# Altium schematic sheet Elevate_sch.SchDoc: CopterControl 3D
size A3; Author: David Ankers; DrawnBy: David Ankers; Engineer: David Ankers; Organization: The OpenPilot Project; DocumentNumber: 1; Revision: A; SheetNumber: 1; SheetTotal: 1; License: Creative Commons BY-SA; ProjectName: OpenPilot
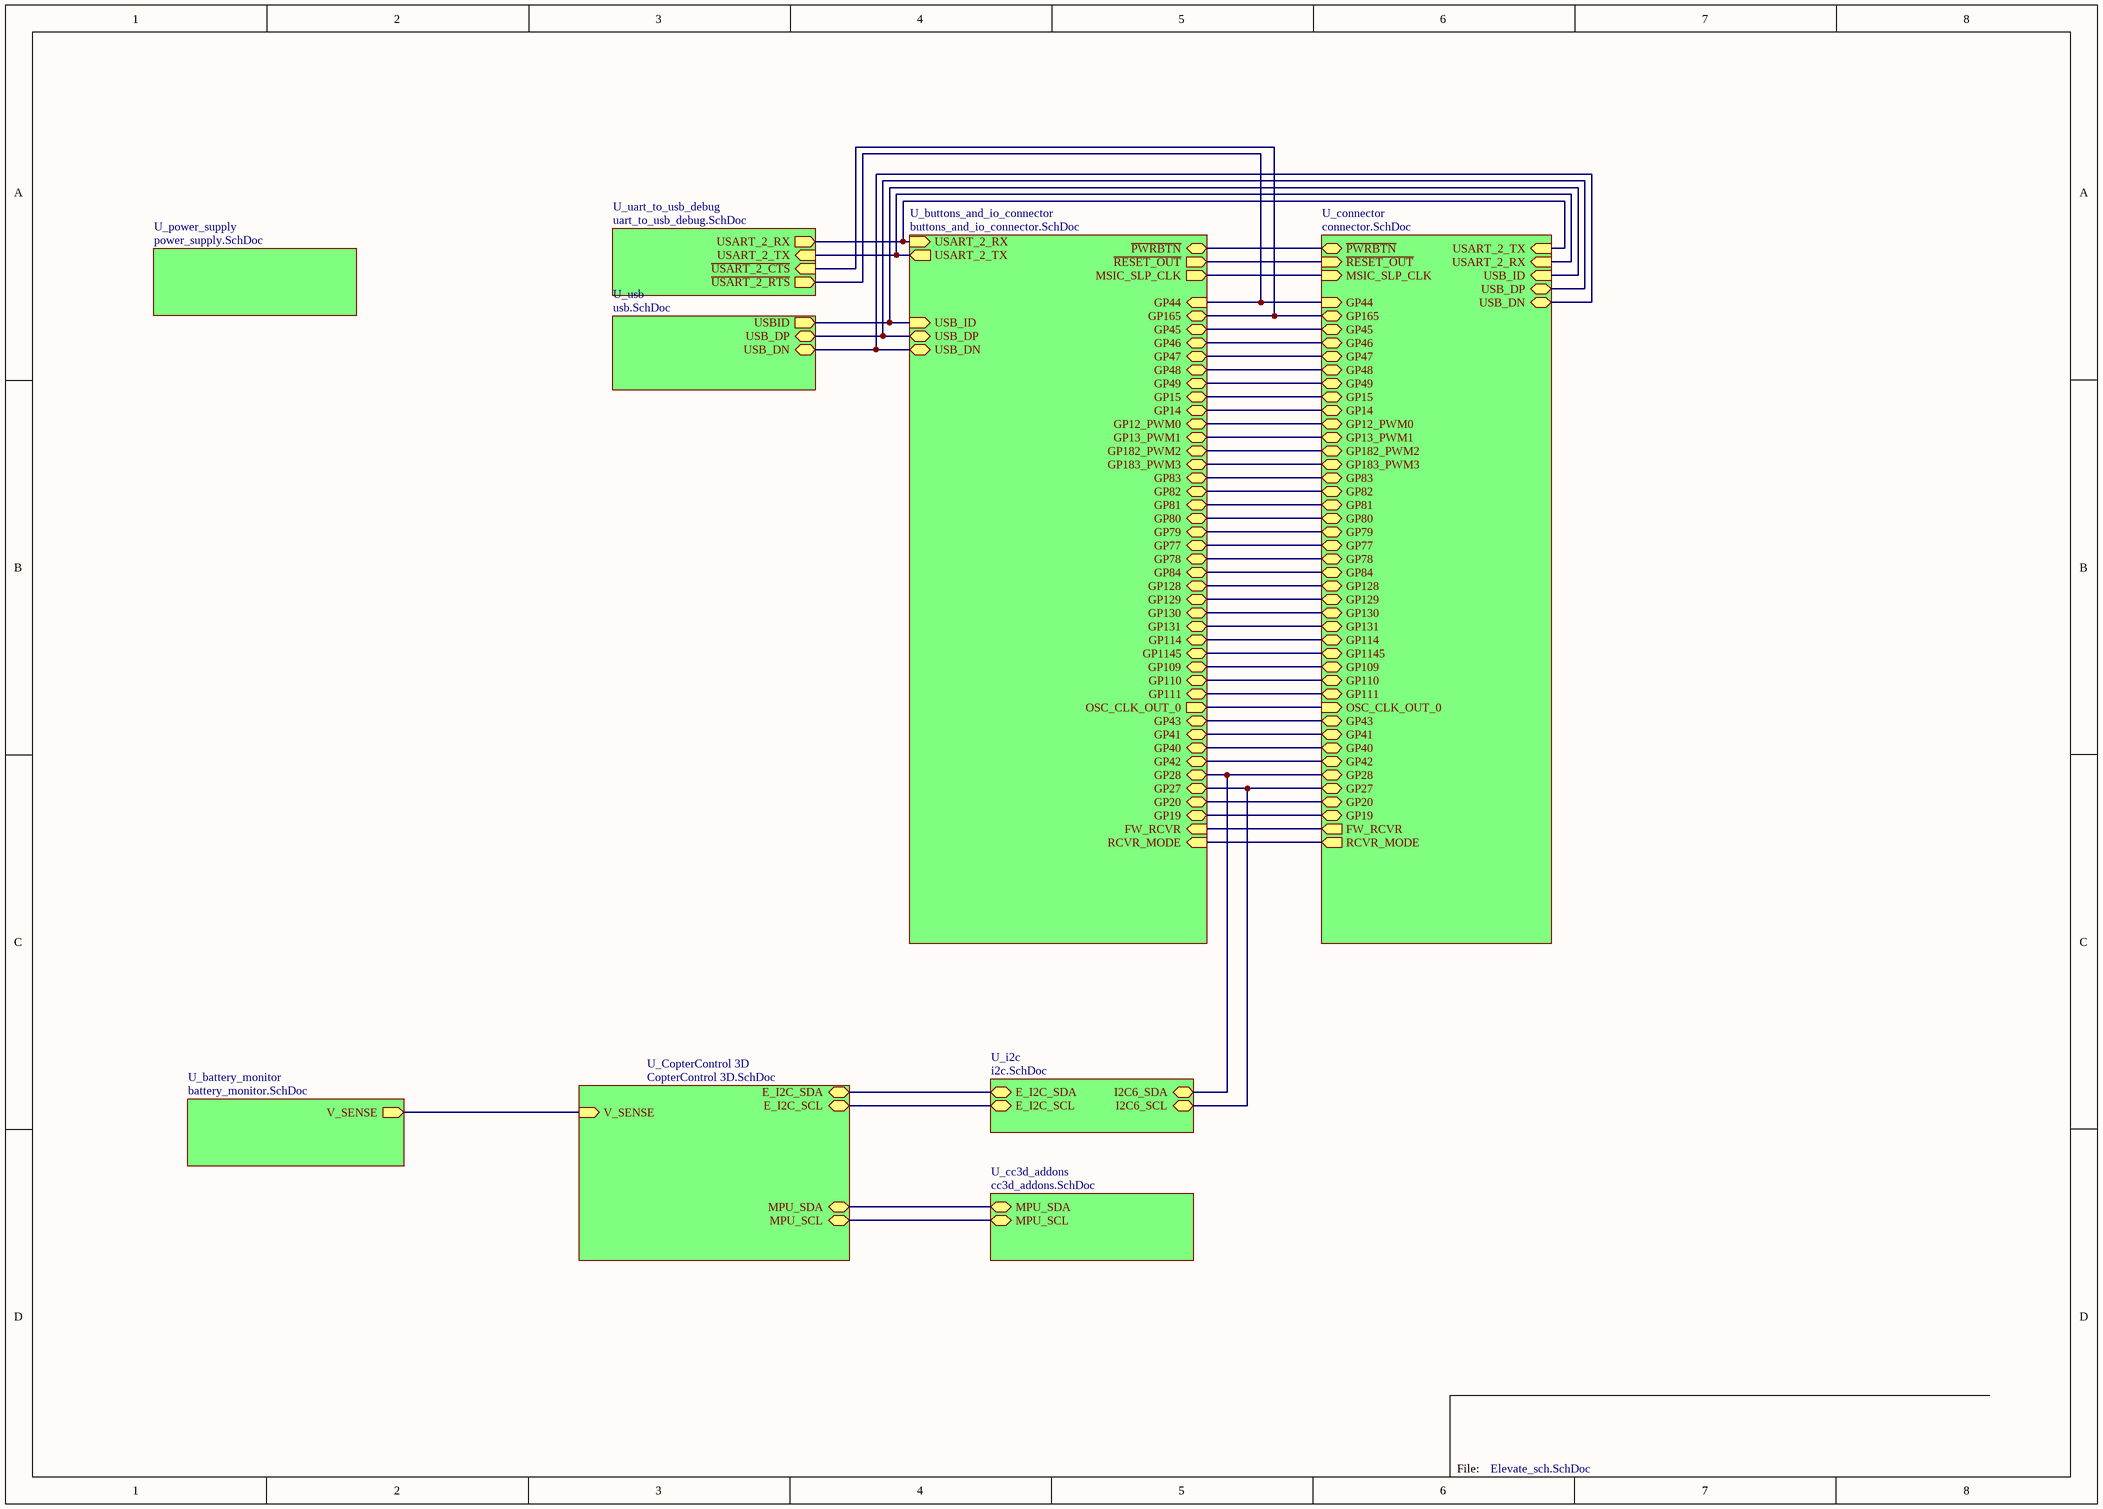
[diagram p0: Elevate_sch.SchDoc]

## Sub-sheets
U_battery_monitor = battery_monitor.SchDoc: V_SENSE (out)
U_buttons_and_io_connector = buttons_and_io_connector.SchDoc: USART_2_TX (out), USART_2_RX (in), USB_ID (in), USB_DP (bidir), USB_DN (bidir), ~{RESET_OUT} (out), MSIC_SLP_CLK (out), ~{PWRBTN} (bidir), GP44 (in), GP165 (bidir), GP45 (bidir), GP46 (bidir), GP47 (bidir), GP48 (bidir), GP49 (bidir), GP15 (bidir), GP14 (bidir), GP12_PWM0 (bidir), GP13_PWM1 (bidir), GP182_PWM2 (bidir), GP183_PWM3 (bidir), FW_RCVR (in), RCVR_MODE (in), OSC_CLK_OUT_0 (out), GP83 (bidir), GP82 (bidir), GP81 (bidir), GP80 (bidir), GP79 (bidir), GP77 (bidir), GP78 (bidir), GP84 (bidir), GP128 (bidir), GP129 (bidir), GP130 (bidir), GP131 (bidir), GP114 (bidir), GP1145 (bidir), GP109 (bidir), GP110 (bidir), GP111 (bidir), GP43 (bidir), GP41 (bidir), GP40 (bidir), GP42 (bidir), GP28 (bidir), GP27 (bidir), GP20 (bidir), GP19 (bidir)
U_cc3d_addons = cc3d_addons.SchDoc: MPU_SDA (bidir), MPU_SCL (bidir)
U_connector = connector.SchDoc: ~{PWRBTN} (bidir), ~{RESET_OUT} (in), MSIC_SLP_CLK (in), GP44 (in), GP165 (bidir), GP45 (bidir), GP46 (bidir), GP47 (bidir), GP48 (bidir), GP49 (bidir), GP15 (bidir), GP12_PWM0 (bidir), GP13_PWM1 (bidir), GP182_PWM2 (bidir), GP183_PWM3 (bidir), GP83 (bidir), GP82 (bidir), GP81 (bidir), GP80 (bidir), GP79 (bidir), GP77 (bidir), GP78 (bidir), GP84 (bidir), GP128 (bidir), GP129 (bidir), GP130 (bidir), GP131 (bidir), GP114 (bidir), GP1145 (bidir), GP109 (bidir), GP110 (bidir), GP111 (bidir), FW_RCVR (out), RCVR_MODE (out), OSC_CLK_OUT_0 (in), GP43 (bidir), GP41 (bidir), GP40 (bidir), GP42 (bidir), GP28 (bidir), GP27 (bidir), GP20 (bidir), GP19 (bidir), GP14 (bidir), USART_2_TX (in), USART_2_RX (in), USB_ID (in), USB_DP (bidir), USB_DN (bidir)
U_CopterControl 3D = CopterControl 3D.SchDoc: E_I2C_SDA (bidir), E_I2C_SCL (bidir), MPU_SCL (bidir), MPU_SDA (bidir), V_SENSE (in)
U_i2c = i2c.SchDoc: I2C6_SDA (bidir), I2C6_SCL (bidir), E_I2C_SDA (bidir), E_I2C_SCL (bidir)
U_power_supply = power_supply.SchDoc: no entries
U_uart_to_usb_debug = uart_to_usb_debug.SchDoc: USART_2_RX (out), USART_2_TX (in), ~{USART_2_CTS} (in), ~{USART_2_RTS} (out)
U_usb = usb.SchDoc: USB_DN (bidir), USB_DP (bidir), USBID (out)

## Nets
(unnamed): sheet U_buttons_and_io_connector/USART_2_TX, sheet U_uart_to_usb_debug/USART_2_TX, sheet U_connector/USART_2_RX
(unnamed): sheet U_buttons_and_io_connector/USART_2_RX, sheet U_uart_to_usb_debug/USART_2_RX, sheet U_connector/USART_2_TX
(unnamed): sheet U_buttons_and_io_connector/USB_ID, sheet U_usb/USBID, sheet U_connector/USB_ID
(unnamed): sheet U_buttons_and_io_connector/USB_DP, sheet U_usb/USB_DP, sheet U_connector/USB_DP
(unnamed): sheet U_buttons_and_io_connector/USB_DN, sheet U_usb/USB_DN, sheet U_connector/USB_DN
(unnamed): sheet U_buttons_and_io_connector/~{RESET_OUT}, sheet U_connector/~{RESET_OUT}
(unnamed): sheet U_buttons_and_io_connector/MSIC_SLP_CLK, sheet U_connector/MSIC_SLP_CLK
(unnamed): sheet U_buttons_and_io_connector/~{PWRBTN}, sheet U_connector/~{PWRBTN}
(unnamed): sheet U_buttons_and_io_connector/GP44, sheet U_uart_to_usb_debug/~{USART_2_RTS}, sheet U_connector/GP44
(unnamed): sheet U_buttons_and_io_connector/GP165, sheet U_uart_to_usb_debug/~{USART_2_CTS}, sheet U_connector/GP165
(unnamed): sheet U_buttons_and_io_connector/GP45, sheet U_connector/GP45
(unnamed): sheet U_buttons_and_io_connector/GP46, sheet U_connector/GP46
(unnamed): sheet U_buttons_and_io_connector/GP47, sheet U_connector/GP47
(unnamed): sheet U_buttons_and_io_connector/GP48, sheet U_connector/GP48
(unnamed): sheet U_buttons_and_io_connector/GP49, sheet U_connector/GP49
(unnamed): sheet U_buttons_and_io_connector/GP15, sheet U_connector/GP15
(unnamed): sheet U_buttons_and_io_connector/GP14, sheet U_connector/GP14
(unnamed): sheet U_buttons_and_io_connector/GP12_PWM0, sheet U_connector/GP12_PWM0
(unnamed): sheet U_buttons_and_io_connector/GP13_PWM1, sheet U_connector/GP13_PWM1
(unnamed): sheet U_buttons_and_io_connector/GP182_PWM2, sheet U_connector/GP182_PWM2
(unnamed): sheet U_buttons_and_io_connector/GP183_PWM3, sheet U_connector/GP183_PWM3
(unnamed): sheet U_buttons_and_io_connector/FW_RCVR, sheet U_connector/FW_RCVR
(unnamed): sheet U_buttons_and_io_connector/RCVR_MODE, sheet U_connector/RCVR_MODE
(unnamed): sheet U_buttons_and_io_connector/OSC_CLK_OUT_0, sheet U_connector/OSC_CLK_OUT_0
(unnamed): sheet U_buttons_and_io_connector/GP83, sheet U_connector/GP83
(unnamed): sheet U_buttons_and_io_connector/GP82, sheet U_connector/GP82
(unnamed): sheet U_buttons_and_io_connector/GP81, sheet U_connector/GP81
(unnamed): sheet U_buttons_and_io_connector/GP80, sheet U_connector/GP80
(unnamed): sheet U_buttons_and_io_connector/GP79, sheet U_connector/GP79
(unnamed): sheet U_buttons_and_io_connector/GP77, sheet U_connector/GP77
(unnamed): sheet U_buttons_and_io_connector/GP78, sheet U_connector/GP78
(unnamed): sheet U_buttons_and_io_connector/GP84, sheet U_connector/GP84
(unnamed): sheet U_buttons_and_io_connector/GP128, sheet U_connector/GP128
(unnamed): sheet U_buttons_and_io_connector/GP129, sheet U_connector/GP129
(unnamed): sheet U_buttons_and_io_connector/GP130, sheet U_connector/GP130
(unnamed): sheet U_buttons_and_io_connector/GP131, sheet U_connector/GP131
(unnamed): sheet U_buttons_and_io_connector/GP114, sheet U_connector/GP114
(unnamed): sheet U_buttons_and_io_connector/GP1145, sheet U_connector/GP1145
(unnamed): sheet U_buttons_and_io_connector/GP109, sheet U_connector/GP109
(unnamed): sheet U_buttons_and_io_connector/GP110, sheet U_connector/GP110
(unnamed): sheet U_buttons_and_io_connector/GP111, sheet U_connector/GP111
(unnamed): sheet U_buttons_and_io_connector/GP43, sheet U_connector/GP43
(unnamed): sheet U_buttons_and_io_connector/GP41, sheet U_connector/GP41
(unnamed): sheet U_buttons_and_io_connector/GP40, sheet U_connector/GP40
(unnamed): sheet U_buttons_and_io_connector/GP42, sheet U_connector/GP42
(unnamed): sheet U_buttons_and_io_connector/GP28, sheet U_connector/GP28, sheet U_i2c/I2C6_SDA
(unnamed): sheet U_buttons_and_io_connector/GP27, sheet U_connector/GP27, sheet U_i2c/I2C6_SCL
(unnamed): sheet U_buttons_and_io_connector/GP20, sheet U_connector/GP20
(unnamed): sheet U_buttons_and_io_connector/GP19, sheet U_connector/GP19
(unnamed): sheet U_i2c/E_I2C_SDA, sheet U_CopterControl 3D/E_I2C_SDA
(unnamed): sheet U_i2c/E_I2C_SCL, sheet U_CopterControl 3D/E_I2C_SCL
(unnamed): sheet U_CopterControl 3D/MPU_SCL, sheet U_cc3d_addons/MPU_SCL
(unnamed): sheet U_CopterControl 3D/MPU_SDA, sheet U_cc3d_addons/MPU_SDA
(unnamed): sheet U_CopterControl 3D/V_SENSE, sheet U_battery_monitor/V_SENSE

## Notes on the sheet
- File: